# Altium schematic sheet Power - VCCINT1V2.SchDoc
size A4
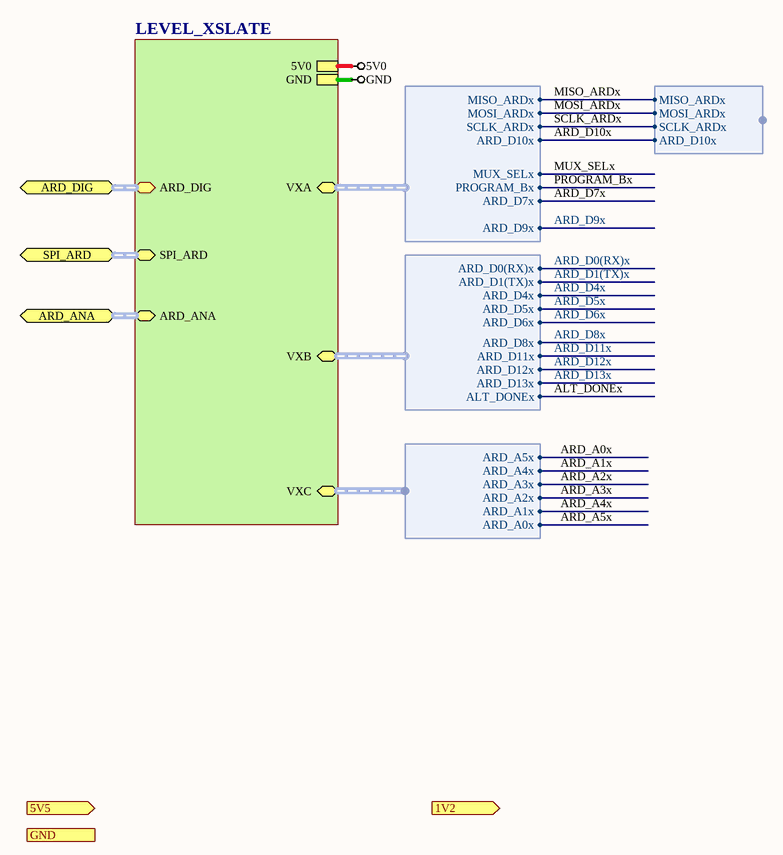
[diagram p0: Power - VCCINT1V2.SchDoc]

## Sub-sheets
LEVEL_XSLATE = Arduino FPGA Level Translation.SchDoc: GND, 5V0, ARD_DIG (harness ARD_DIG), SPI_ARD (harness SPI_ARD), VXA (harness VXA), VXB (harness VXB), ARD_ANA (harness ARD_ANA), VXC (harness VXC)

## Ports
1V2 (out), 5V5 (in), ARD_ANA (harness ARD_ANA), ARD_DIG (harness ARD_DIG), GND, SPI_ARD (harness SPI_ARD)

## Harnesses
VXB: ARD_D0(RX)x, ARD_D1(TX)x, ARD_D4x, ARD_D5x, ARD_D6x, ARD_D8x, ARD_D11x, ARD_D12x, ARD_D13x, ALT_DONEx
SPI_ARDx: MISO_ARDx, MOSI_ARDx, SCLK_ARDx, ARD_D10x
VXA: MISO_ARDx, MOSI_ARDx, SCLK_ARDx, MUX_SELx, PROGRAM_Bx, ARD_D7x, ARD_D10x, ARD_D9x
VXC: ARD_A0x, ARD_A1x, ARD_A2x, ARD_A3x, ARD_A4x, ARD_A5x

## Nets
5V0: sheet LEVEL_XSLATE/5V0
GND: sheet LEVEL_XSLATE/GND
ALT_DONEx: sheet LEVEL_XSLATE/VXB.ALT_DONEx
ARD_A0x: sheet LEVEL_XSLATE/VXC.ARD_A5x
ARD_A1x: sheet LEVEL_XSLATE/VXC.ARD_A4x
ARD_A2x: sheet LEVEL_XSLATE/VXC.ARD_A3x
ARD_A3x: sheet LEVEL_XSLATE/VXC.ARD_A2x
ARD_A4x: sheet LEVEL_XSLATE/VXC.ARD_A1x
ARD_A5x: sheet LEVEL_XSLATE/VXC.ARD_A0x
ARD_D0(RX)x: sheet LEVEL_XSLATE/VXB.ARD_D0(RX)x
ARD_D1(TX)x: sheet LEVEL_XSLATE/VXB.ARD_D1(TX)x
ARD_D4x: sheet LEVEL_XSLATE/VXB.ARD_D4x
ARD_D5x: sheet LEVEL_XSLATE/VXB.ARD_D5x
ARD_D6x: sheet LEVEL_XSLATE/VXB.ARD_D6x
ARD_D7x: sheet LEVEL_XSLATE/VXA.ARD_D7x
ARD_D8x: sheet LEVEL_XSLATE/VXB.ARD_D8x
ARD_D9x: sheet LEVEL_XSLATE/VXA.ARD_D9x
ARD_D10x: harness SPI_ARDx.ARD_D10x, sheet LEVEL_XSLATE/VXA.ARD_D10x
ARD_D11x: sheet LEVEL_XSLATE/VXB.ARD_D11x
ARD_D12x: sheet LEVEL_XSLATE/VXB.ARD_D12x
ARD_D13x: sheet LEVEL_XSLATE/VXB.ARD_D13x
MISO_ARDx: harness SPI_ARDx.MISO_ARDx, sheet LEVEL_XSLATE/VXA.MISO_ARDx
MOSI_ARDx: harness SPI_ARDx.MOSI_ARDx, sheet LEVEL_XSLATE/VXA.MOSI_ARDx
MUX_SELx: sheet LEVEL_XSLATE/VXA.MUX_SELx
PROGRAM_Bx: sheet LEVEL_XSLATE/VXA.PROGRAM_Bx
SCLK_ARDx: harness SPI_ARDx.SCLK_ARDx, sheet LEVEL_XSLATE/VXA.SCLK_ARDx

## Buses and harness runs
harness port ARD_ANA = sheet LEVEL_XSLATE/ARD_ANA
harness port ARD_DIG = sheet LEVEL_XSLATE/ARD_DIG
harness port SPI_ARD = sheet LEVEL_XSLATE/SPI_ARD